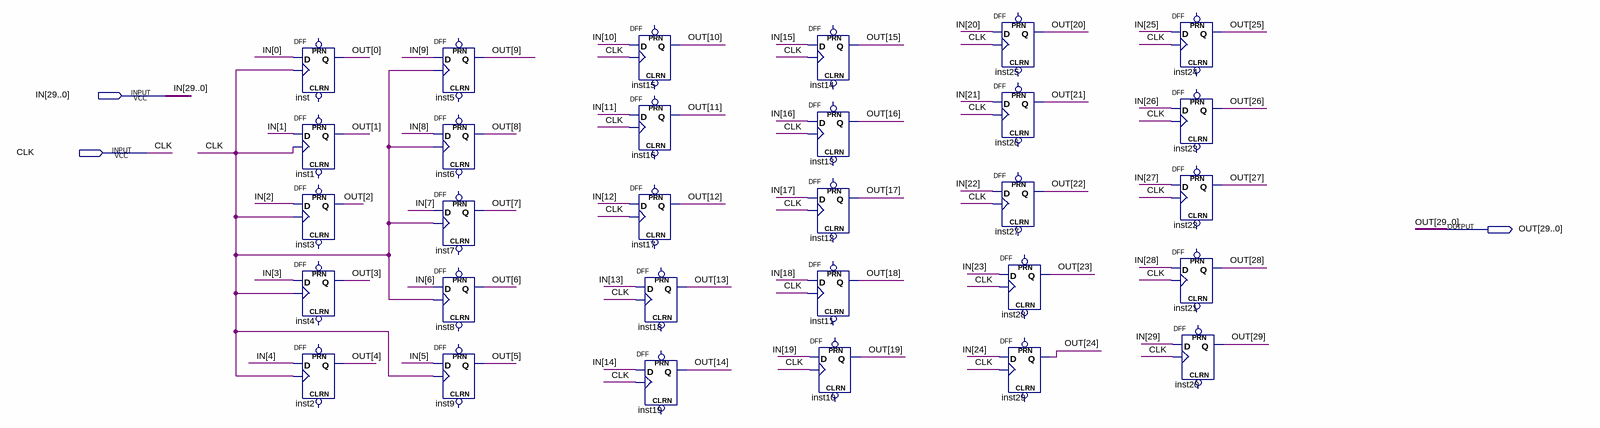
[diagram p0: schematic sheet]
// Quartus schematic register30bit.bdf as structural Verilog: 30 symbols, 3 pins
module register30bit (
  input  [29:0] IN,
  input  CLK,
  output [29:0] OUT
);

  DFF inst (.CLK(CLK), .D(IN[0]), .Q(OUT[0]));  // open: CLRN, PRN
  DFF inst1 (.CLK(CLK), .D(IN[1]), .Q(OUT[1]));  // open: CLRN, PRN
  DFF inst3 (.CLK(CLK), .D(IN[2]), .Q(OUT[2]));  // open: CLRN, PRN
  DFF inst4 (.CLK(CLK), .D(IN[3]), .Q(OUT[3]));  // open: CLRN, PRN
  DFF inst2 (.CLK(CLK), .D(IN[4]), .Q(OUT[4]));  // open: CLRN, PRN
  DFF inst5 (.CLK(CLK), .D(IN[9]), .Q(OUT[9]));  // open: CLRN, PRN
  DFF inst6 (.CLK(CLK), .D(IN[8]), .Q(OUT[8]));  // open: CLRN, PRN
  DFF inst7 (.CLK(CLK), .D(IN[7]), .Q(OUT[7]));  // open: CLRN, PRN
  DFF inst8 (.CLK(CLK), .D(IN[6]), .Q(OUT[6]));  // open: CLRN, PRN
  DFF inst9 (.CLK(CLK), .D(IN[5]), .Q(OUT[5]));  // open: CLRN, PRN
  DFF inst15 (.CLK(CLK), .D(IN[10]), .Q(OUT[10]));  // open: CLRN, PRN
  DFF inst16 (.CLK(CLK), .D(IN[11]), .Q(OUT[11]));  // open: CLRN, PRN
  DFF inst17 (.CLK(CLK), .D(IN[12]), .Q(OUT[12]));  // open: CLRN, PRN
  DFF inst18 (.CLK(CLK), .D(IN[13]), .Q(OUT[13]));  // open: CLRN, PRN
  DFF inst19 (.CLK(CLK), .D(IN[14]), .Q(OUT[14]));  // open: CLRN, PRN
  DFF inst14 (.CLK(CLK), .D(IN[15]), .Q(OUT[15]));  // open: CLRN, PRN
  DFF inst13 (.CLK(CLK), .D(IN[16]), .Q(OUT[16]));  // open: CLRN, PRN
  DFF inst12 (.CLK(CLK), .D(IN[17]), .Q(OUT[17]));  // open: CLRN, PRN
  DFF inst11 (.CLK(CLK), .D(IN[18]), .Q(OUT[18]));  // open: CLRN, PRN
  DFF inst10 (.CLK(CLK), .D(IN[19]), .Q(OUT[19]));  // open: CLRN, PRN
  DFF inst25 (.CLK(CLK), .D(IN[20]), .Q(OUT[20]));  // open: CLRN, PRN
  DFF inst26 (.CLK(CLK), .D(IN[21]), .Q(OUT[21]));  // open: CLRN, PRN
  DFF inst27 (.CLK(CLK), .D(IN[22]), .Q(OUT[22]));  // open: CLRN, PRN
  DFF inst28 (.CLK(CLK), .D(IN[23]), .Q(OUT[23]));  // open: CLRN, PRN
  DFF inst29 (.CLK(CLK), .D(IN[24]), .Q(OUT[24]));  // open: CLRN, PRN
  DFF inst24 (.CLK(CLK), .D(IN[25]), .Q(OUT[25]));  // open: CLRN, PRN
  DFF inst23 (.CLK(CLK), .D(IN[26]), .Q(OUT[26]));  // open: CLRN, PRN
  DFF inst22 (.CLK(CLK), .D(IN[27]), .Q(OUT[27]));  // open: CLRN, PRN
  DFF inst21 (.CLK(CLK), .D(IN[28]), .Q(OUT[28]));  // open: CLRN, PRN
  DFF inst20 (.CLK(CLK), .D(IN[29]), .Q(OUT[29]));  // open: CLRN, PRN
endmodule
